# EAGLE design PDB (EAGLE 9.5.2)
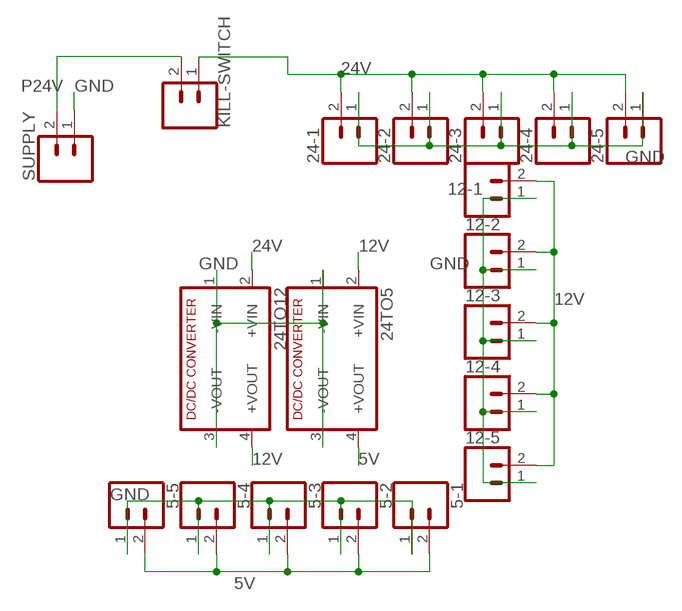
[diagram p0: schematic, sheet 1]

## Parts
5-1  CONN_02  [1X02]
5-2  CONN_02  [1X02]
5-3  CONN_02  [1X02]
5-4  CONN_02  [1X02]
5-5  CONN_02  [1X02]
12-1  CONN_02  [1X02]
12-2  CONN_02  [1X02]
12-3  CONN_02  [1X02]
12-4  CONN_02  [1X02]
12-5  CONN_02  [1X02]
24-1  CONN_02  [1X02]
24-2  CONN_02  [1X02]
24-3  CONN_02  [1X02]
24-4  CONN_02  [1X02]
24-5  CONN_02  [1X02]
24TO5  NME  [NME]
24TO12  NME  [NME]
KILL-SWITCH  CONN_02  [1X02]
SUPPLY  CONN_02  [1X02]

## Nets
5V: 5-1.2 5-2.2 5-3.2 5-4.2 5-5.2 24TO5.4(+VOUT)
12V: 12-1.2 12-2.2 12-3.2 12-4.2 12-5.2 24TO5.2(+VIN) 24TO12.4(+VOUT)
24V: 24-1.2 24-2.2 24-3.2 24-4.2 24-5.2 24TO12.2(+VIN) KILL-SWITCH.1
GND: 5-1.1 5-2.1 5-3.1 5-4.1 5-5.1 12-1.1 12-2.1 12-3.1 12-4.1 12-5.1 24-1.1 24-2.1 24-3.1 24-4.1 24-5.1 24TO5.1(-VIN) 24TO5.3(-VOUT) 24TO12.1(-VIN) 24TO12.3(-VOUT) SUPPLY.1
P24V: KILL-SWITCH.2 SUPPLY.2

## Library data of the parts
5-1-5-5 12-1-12-5 24-1-24-5 KILL-SWITCH SUPPLY = SparkFun-Connectors:CONN_02: Multi connection point. Often used as Generic Header-pin footprint for 0.1 inch spaced/style header connections On any of the 0.1 inch spaced packages, you can populate with these: Break Away Headers - Straight <https://www.sparkfun.com/products/116> (PRT-00116) Break Away Male Headers - Right Angle <https://www.sparkfun.com/products/553> (PRT-00553) Female Headers <https://www.sparkfun.com/products/115> (PRT-00115) Break Away Headers - Machine Pin <https://www.sparkfun.com/products/117> (PRT-00117) Break Away Female Headers - Swiss Machine Pin <https://www.sparkfun.com/products/743> (PRT-00743) For SCREWTERMINALS and SPRING TERMINALS visit here: Screw Terimnals on SparkFun.com <https://www.sparkfun.com/search/results?term=Screw+Terminals> (5mm/3.5mm/2.54mm spacing) This device is also useful as a general connection point to wire up your design to another part of your project. Our various solder wires solder well into these plated through hole pads. Hook-Up Wire - Assortment (Stranded, 22 AWG) <https://www.sparkfun.com/products/11375> (PRT-11375) Hook-Up Wire - Assortment (Solid Core, 22 AWG) <https://www.sparkfun.com/products/11367> (PRT-11367) View the entire wire category on our website here <https://www.sparkfun.com/categories/141> Special notes: Molex polarized connector foot print use with: PRT-08233 with associated crimp pins and housings. 2.54_SCREWTERM for use with PRT-10571. 3.5mm Screw Terminal footprints for PRT-08084 5mm Screw Terminal footprints for use with PRT-08432
24TO5 24TO12 = dc-dc-converter:NME: DC-DC CONVERTER; MF: C & D TECHNOLOGIES, INC; MPN: NME1205D; OC_FARNELL: 1021466; OC_NEWARK: 98B8198

## Board
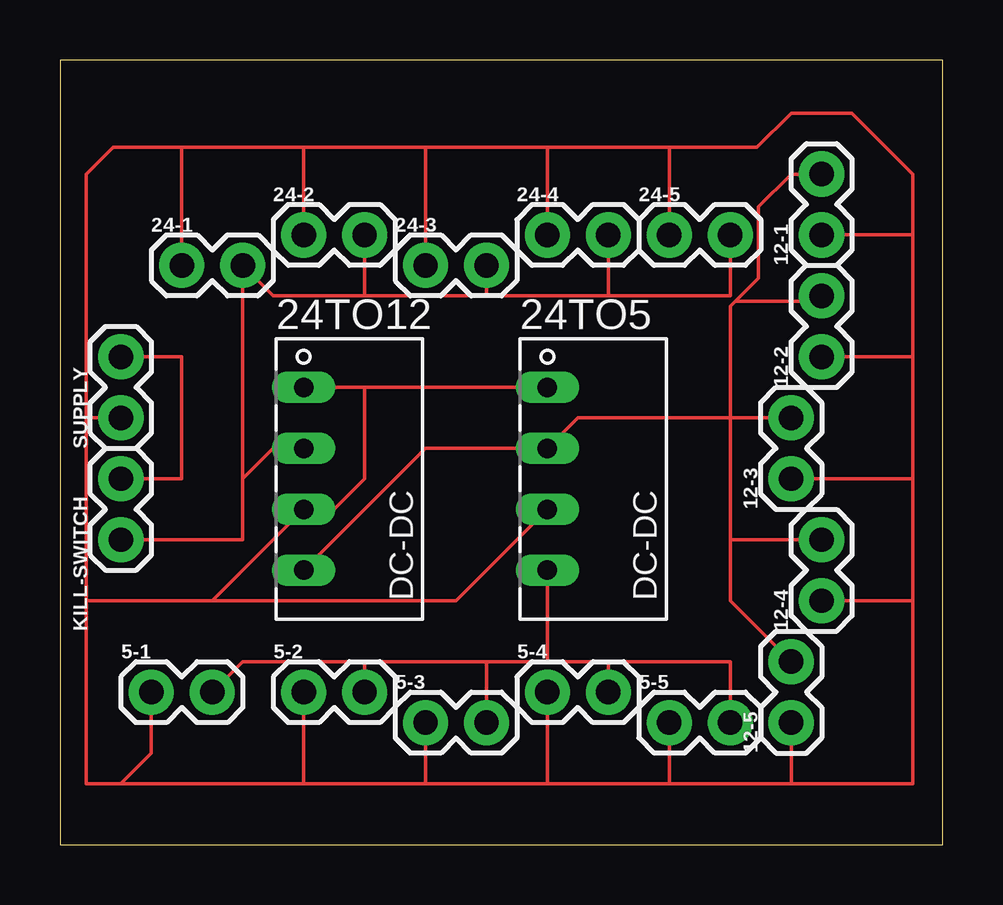
[diagram p1: board, top side]

Size 36.81 x 32.69 mm. Coordinates in mm from the lower left corner, seen from the top.
Outline: 0,0 36.81,0 36.81,32.69 0,32.69 0,0
Copper layers (1*16): Top 0.035mm / dielectric 1.5mm / Bottom 0.035mm
Design rules "default": minimum track width 6mil, minimum drill 0.35mm, track to track 6mil, track to pad 6mil, pad to pad 6mil, via to via 6mil, smd to smd 6mil, copper to edge 40mil, drill to drill 6mil, minimum pad ring 10mil, minimum via ring 8mil, stop-mask expansion 4mil, vias tented up to drill 0mil, thermal gap 10mil

### Footprints (pad centres in the part's own frame; a part is rotated, then mirrored left to right if it is on the bottom)
1X02 = drill 1.016 pad 1.88: 1 0,0; 2 2.54,0
NME = drill 0.813 long: 1 0,3.81; 2 0,1.27; 3 0,-1.27; 4 0,-3.81

### Placement (x,y rotation side)
5-1  3.81,6.35 0 top
5-2  10.16,6.35 0 top
5-3  15.24,5.08 0 top
5-4  20.32,6.35 0 top
5-5  25.4,5.08 0 top
12-1  31.75,25.4 90 top
12-2  31.75,20.32 90 top
12-3  30.48,15.24 90 top
12-4  31.75,10.16 90 top
12-5  30.48,5.08 90 top
24-1  5.08,24.13 0 top
24-2  10.16,25.4 0 top
24-3  15.24,24.13 0 top
24-4  20.32,25.4 0 top
24-5  25.4,25.4 0 top
24TO5  20.32,15.24 0 top
24TO12  10.16,15.24 0 top
KILL-SWITCH  2.54,12.7 90 top
SUPPLY  2.54,17.78 90 top

### Tracks (layer width: path | path; a pad name or v marks a point on that pad's centre or on a via)
5V
  Top 0.152: 5-5.2 27.94,7.62 22.86,7.62 | 22.86,7.62 20.32,7.62 | 20.32,7.62 17.78,7.62 | 17.78,7.62 12.7,7.62 | 12.7,7.62 7.62,7.62 5-1.2 | 5-2.2 12.7,7.62 | 5-3.2 17.78,7.62 | 5-4.2 22.86,7.62 | 24TO5.4 20.32,7.62
12V
  Top 0.152: 24TO12.4 15.24,16.51 24TO5.2 21.59,17.78 27.94,17.78 | 12-1.2 30.48,27.94 29.11,26.57 29.11,23.6 28.16,22.64 | 27.94,12.7 27.94,10.16 12-5.2 | 27.94,12.7 27.94,17.78 | 27.94,17.78 27.94,22.43 28.16,22.64 | 12-4.2 27.94,12.7 | 12-3.2 27.94,17.78 | 12-2.2 31.53,22.64 28.16,22.64
24V
  Top 0.152: KILL-SWITCH.1 7.62,12.7 7.62,15.24 | 7.62,15.24 24-1.2 8.89,22.86 12.7,22.86 | 24TO12.2 8.89,16.51 7.62,15.24 | 12.7,22.86 17.78,22.86 | 17.78,22.86 22.86,22.86 | 22.86,22.86 27.94,22.86 24-5.2 | 24-4.2 22.86,22.86 | 24-3.2 17.78,22.86 | 24-2.2 12.7,22.86
GND
  Top 0.152: SUPPLY.1 1.09,17.78 | 1.09,17.78 1.09,27.94 2.21,29.06 5.08,29.06 | 35.56,25.4 35.56,27.94 33.02,30.48 30.48,30.48 29.06,29.06 25.4,29.06 | 35.56,25.4 35.56,20.32 | 35.56,20.32 35.56,15.24 | 35.56,15.24 35.56,10.16 | 35.56,10.16 35.56,2.54 30.48,2.54 | 30.48,2.54 25.4,2.54 | 25.4,2.54 20.32,2.54 | 20.32,2.54 15.24,2.54 | 15.24,2.54 10.16,2.54 | 10.16,2.54 2.54,2.54 | 2.54,2.54 1.09,2.54 1.09,10.16 | 1.09,10.16 1.09,17.78 | 5.08,29.06 10.16,29.06 | 10.16,29.06 15.24,29.06 | 15.24,29.06 20.32,29.06 | 20.32,29.06 25.4,29.06 | 24-1.1 5.08,29.06 | 24-2.1 10.16,29.06 | 24-3.1 15.24,29.06 | 24-4.1 20.32,29.06 | 24-5.1 25.4,29.06 | 12-1.1 35.56,25.4 | 12-2.1 35.56,20.32 | 12-3.1 35.56,15.24 | 12-4.1 35.56,10.16 | 12-5.1 30.48,2.54 | 5-5.1 25.4,2.54 | 5-4.1 20.32,2.54 | 5-3.1 15.24,2.54 | 5-2.1 10.16,2.54 | 5-1.1 3.81,3.81 2.54,2.54 | 24TO5.1 12.7,19.05 | 12.7,19.05 24TO12.1 | 6.35,10.16 1.09,10.16 | 6.35,10.16 24TO12.3 11.43,13.97 12.7,15.24 12.7,19.05 | 24TO5.3 16.51,10.16 6.35,10.16
P24V
  Top 0.152: SUPPLY.2 5.08,20.32 5.08,15.24 KILL-SWITCH.2